# Altium project plp-cp_2a.PrjPcb
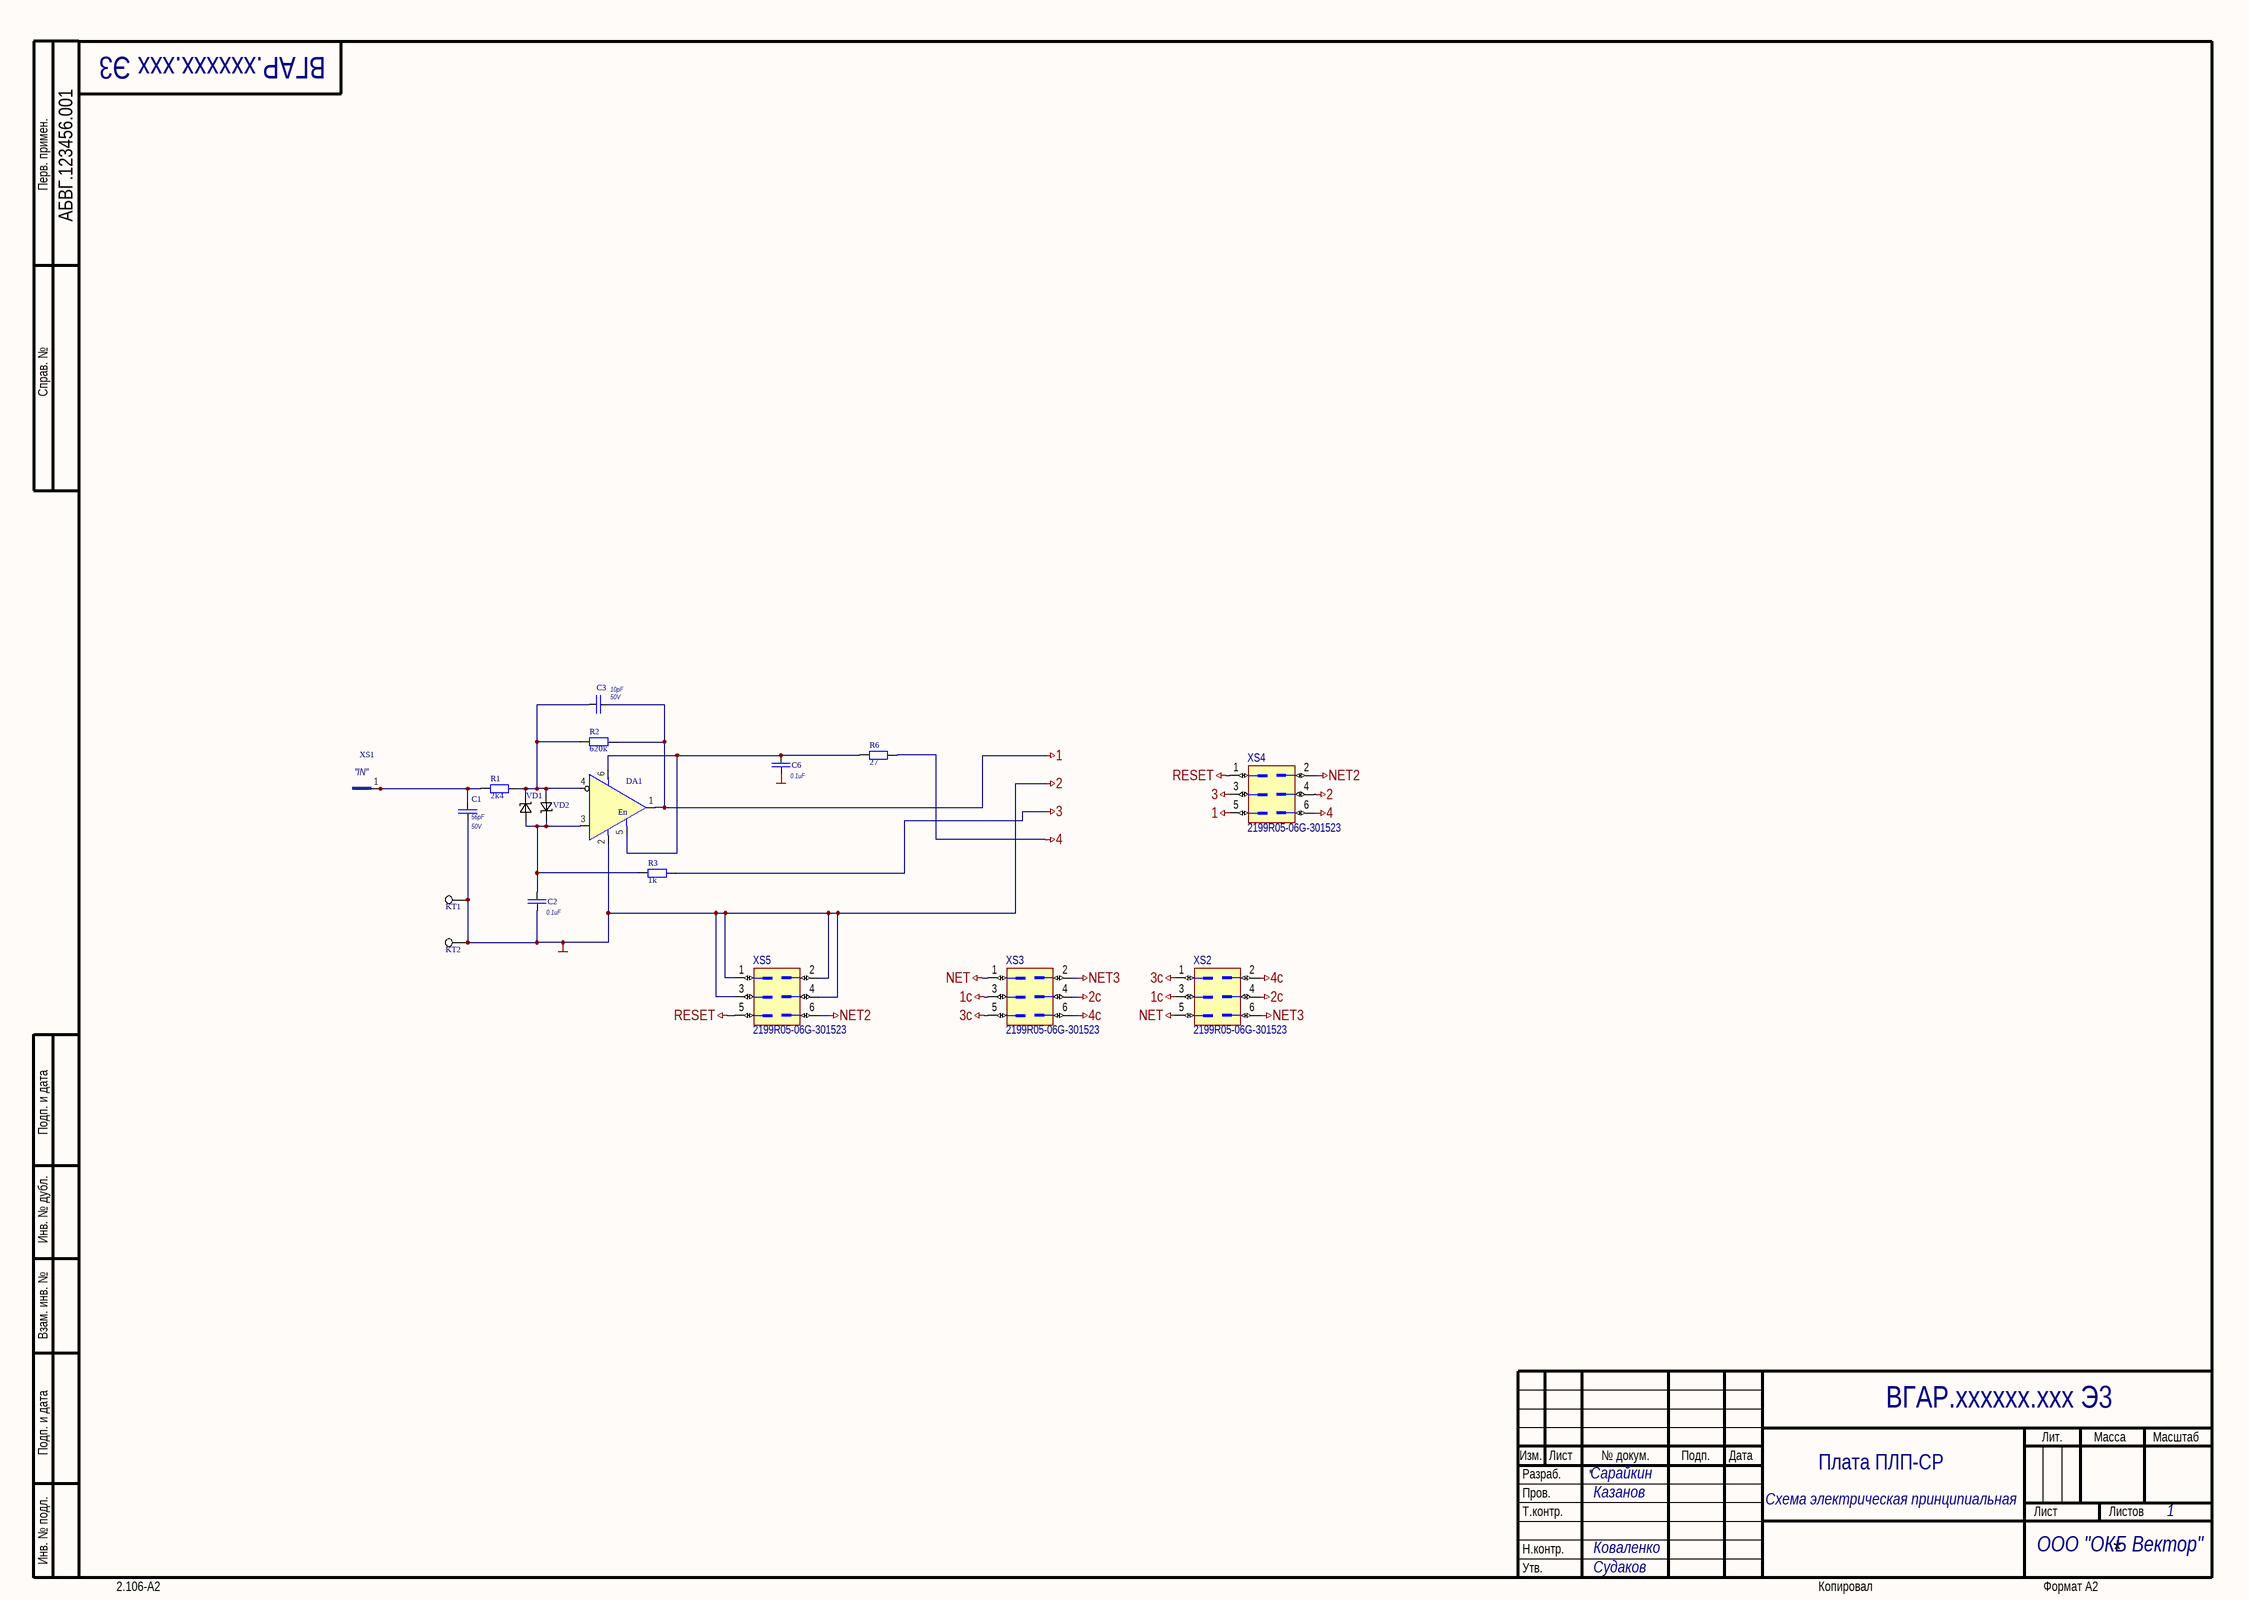
[diagram p0: plp-cp_2a.SchDoc]
1 sheet, 18 parts. Net scope: global (net labels, ports and power ports of the same name join across sheets).
Board file: plp-cp_2a.PcbDoc

## Sheet plp-cp_2a.SchDoc
size 594 x 420 mm; PageSetup: Record=PageOptions|CenterHorizontal=False|CenterVertical=False|PrintScale=0.68|XCorrection=0.00|YCorrection=0.00|PrintKind=2|BorderSize=5000000|LeftOffset=0|BottomOffset=0|Orientation=2|PaperLength=4200|PaperWidth=2970|Scale=100|PaperSource=7|PrintQuality=600|MediaType=1|DitherType=10|PaperKind=A3|PrintScaleMode=1; FirstReferrence: АБВГ.123456.001; Rule: PcbType=ProtelPcb; Rule: PcbType=ProtelPcb; Rule: PcbType=ProtelPcb; Rule: PcbType=ProtelPcb; Rule: PcbType=ProtelPcb; Rule: PcbType=ProtelPcb; Rule: PcbType=ProtelPcb; Rule: PcbType=ProtelPcb; Rule: PcbType=ProtelPcb; Rule: PcbType=ProtelPcb; Rule: PcbType=ProtelPcb; Rule: PcbType=ProtelPcb

### Parts
C1  value 56pF  Rated DC Voltage: 50V  [CAPC_0603(1608)X080L]  (hidden comment: Capacitor Ceramic)
C2  value 0.1uF  [CAPC_0603(1608)X080L]  (hidden comment: Capacitor Ceramic)
C3  value 10pF  Rated DC Voltage: 50V  [CAPC_0603(1608)X080L]  (hidden comment: Capacitor Ceramic)
C6  value 0.1uF  [CAPC_0603(1608)X080L]  (hidden comment: Capacitor Ceramic)
DA1  OPA363AIDBV  [SOT23-6]  (value not drawn)
KT1  Testpoint-TH-1mm  [1mm PAD]  (value not drawn)  (net tie, no BOM)
KT2  Testpoint-TH-1mm  [1mm PAD]  (value not drawn)  (net tie, no BOM)
R1  value 2k4  [RESC1608(0603)X04L]  (hidden comment: R0603L)
R2  value 620k  [RESC1608(0603)X04L]  (hidden comment: R0603L)
R3  value 1k  [RESC1608(0603)X04L]  (hidden comment: R0603L)
R6  value 27  [RESC1608(0603)X04L]  (hidden comment: R0603L)
VD1  BAT54XV2  [SOD523 - ONs]  (value not drawn)
VD2  BAT54XV2  [SOD523 - ONs]  (value not drawn)
XS1  smd_pin  [smd_pin]  (value not drawn)
XS2  2199R05-06G-301523  [CON: PLL-6(2x3R1.27male)]
XS3  2199R05-06G-301523  [CON: PLL-6(2x3R1.27male)]
XS4  2199R05-06G-301523  [CON: PLL-6(2x3R1.27male)]
XS5  2199R05-06G-301523  [CON: PLL-6(2x3R1.27male)]

### Nets
1: C3.2 DA1.1(Vout) R2.2 XS4.5
1c: XS2.3 XS3.3
2: C1.2 C2.2 C6.2 DA1.2(-V) KT1.0 KT2.0 XS4.4 XS5.1 XS5.2 XS5.3 XS5.4  [also labelled GND]
2c: XS2.4 XS3.4
3: R3.2 XS4.3
3c: XS2.1 XS3.5
4: R6.1 XS4.6
4c: XS2.2 XS3.6
NET: XS2.5 XS3.1
NET2: XS4.2 XS5.6
NET3: XS2.6 XS3.2
RESET: XS4.1 XS5.5
NetC1_1: C1.1 R1.2 XS1.1
NetC2_1: C2.1 DA1.3(+In) R3.1 VD1.1(anode) VD2.2(catode)
NetC3_1: C3.1 DA1.4(-In) R1.1 R2.1 VD1.2(catode) VD2.1(anode)
NetC6_1: C6.1 DA1.5(EN) DA1.6(+V) R6.2

### Notes on the sheet
- ВГАР.xxxxxx.xxx Э3
- (near XS1) "IN"
- Плата ПЛП-CP
- Сарайкин
- Казанов
- Схема электрическая принципиальная
- 1
- Коваленко
- ООО "ОКБ Вектор"
- Судаков
- Перв. примен.
- Справ. №
- Подп. и дата
- Инв. № дубл.
- Взам. инв. №
- Разраб.
- Изм.
- Лист
- № докум.
- Подп.
- Дата
- Лит.
- Масса
- Масштаб
- Пров.
- Т.контр.
- Листов
- Инв. № подл.
- Утв.
- Н.контр.
- 2.106-A2
- Копировал
- Формат А2
- (in symbol OPA363AIDBV) En

### Library data of the parts
C1 = Capacitor Ceramic: Конденсатор; Manufacturer: Murata; ReplacementPart1Manufacturer: TDK; ReplacementPart2Manufacturer: Taiyo Yuden; ESR: * mOhm; OrderCode: 0603 - 56пФ ±10% - 50В - NPO; TC Code: NPO; Tolerance: ±5%; Case: 0603; ComponentLink1Description: Global Data; ComponentLink1URL: http://www.murata.com/products/capacitor/tech_data/index.html; ComponentLink2Description: Part Data Sheet; ComponentLink2URL: *; ComponentLink3Description: Replacement Data Sheet; ComponentLink3URL: *; ComponentLink4Description: Replacement 2 Data Sheet; ComponentLink4URL: *; PartNumber: *; ReplacementPart1PartNumber: *; ReplacementPart2PartNumber: *; Ripple Current Rating: *; Temperature Range: -55 to +125°C
C2 C6 = Capacitor Ceramic: Конденсатор; Manufacturer: Murata; ReplacementPart1Manufacturer: TDK; ReplacementPart2Manufacturer: Taiyo Yuden; ESR: * mOhm; OrderCode: 0603 - 0,1мкФ ±10% - 50В - X7R; TC Code: X7R; Tolerance: ±10%; Rated DC Voltage: 50V; Case: 0603; ComponentLink1Description: Global Data; ComponentLink1URL: http://www.murata.com/products/capacitor/tech_data/index.html; ComponentLink2Description: Part Data Sheet; ComponentLink2URL: *; ComponentLink3Description: Replacement Data Sheet; ComponentLink3URL: *; ComponentLink4Description: Replacement 2 Data Sheet; ComponentLink4URL: *; PartNumber: *; ReplacementPart1PartNumber: *; ReplacementPart2PartNumber: *; Ripple Current Rating: *; Temperature Range: -55 to +125°C
C3 = Capacitor Ceramic: Конденсатор; Manufacturer: Murata; ReplacementPart1Manufacturer: TDK; ReplacementPart2Manufacturer: Taiyo Yuden; ESR: * mOhm; OrderCode: 0603 - 10 пФ ±5% 50 В- NPO; TC Code: NPO; Tolerance: ±5%; Case: 0603; ComponentLink1Description: Global Data; ComponentLink1URL: http://www.murata.com/products/capacitor/tech_data/index.html; ComponentLink2Description: Part Data Sheet; ComponentLink2URL: *; ComponentLink3Description: Replacement Data Sheet; ComponentLink3URL: *; ComponentLink4Description: Replacement 2 Data Sheet; ComponentLink4URL: *; PartNumber: *; ReplacementPart1PartNumber: *; ReplacementPart2PartNumber: *; Ripple Current Rating: *; Temperature Range: -55 to +125°C
DA1 = OPA363AIDBV: Микросхема; Manufacturer: Texas Instruments; ComponentLink1Description: Data Sheet; ComponentLink1URL: http://focus.ti.com/lit/ds/symlink/opa363.pdf; ComponentLink2Description: Replacement 1 Data Sheet; ComponentLink2URL: *; ComponentLink3Description: Replacement 2 Data Sheet; ComponentLink3URL: *; PartNumber: OPA363AIDBV; ReplacementPart1Manufacturer: *; ReplacementPart1PartNumber: *; ReplacementPart1TopMarking: *; ReplacementPart2Manufacturer: *; ReplacementPart2PartNumber: *; ReplacementPart2TopMarking: *; TopMarking: *
KT1 KT2 = Testpoint-TH-1mm: Dummy Pad
R1 R3 R6 = R0603L: Резистор; Manufacturer: Bourns; Max Rated DC Voltage: 100 В; Power: 1/10 Вт; Rated DC Voltage: 50 В; Rated T: -55 °C to +125 °C; Resistance Code: 0603 {Value} Ом ±1 %; TKR: ±100 ppm; Tolerance: ±1 %; ComponentLink1Description: Data Sheet; ComponentLink1URL: http://smd.ru/files/upload/1207/ru/chip-resis.pdf; Case: 0603; ComponentLink2Description: Specific Res Only; ComponentLink2URL: *; ComponentLink3Description: Replacement Data Sheet; ComponentLink3URL: *; ComponentLink4Description: Replacement 2 Data Sheet; ComponentLink4URL: *; OrderCode: *; PartNumber: *; ReplacementPart1Manufacturer: *; ReplacementPart1PartNumber: *; ReplacementPart2Manufacturer: *; ReplacementPart2PartNumber: *; Temperature Range: -55 to +125°C
R2 = R0603L: Резистор; Manufacturer: Bourns; Max Rated DC Voltage: 100 В; Power: 1/10 Вт; Rated DC Voltage: 50 В; Rated T: -55 °C to +125 °C; Resistance Code: 0603 240 kОм ±1 %; TKR: ±100 ppm; Tolerance: ±1 %; ComponentLink1Description: Data Sheet; ComponentLink1URL: http://smd.ru/files/upload/1207/ru/chip-resis.pdf; Case: 0603; ComponentLink2Description: Specific Res Only; ComponentLink2URL: *; ComponentLink3Description: Replacement Data Sheet; ComponentLink3URL: *; ComponentLink4Description: Replacement 2 Data Sheet; ComponentLink4URL: *; OrderCode: *; PartNumber: *; ReplacementPart1Manufacturer: *; ReplacementPart1PartNumber: *; ReplacementPart2Manufacturer: *; ReplacementPart2PartNumber: *; Temperature Range: -55 to +125°C
VD1 VD2 = BAT54XV2: shottky diode; Manufacturer: ON Semiconductor; ComponentLink1Description: Data Sheet; ComponentLink2Description: Replacement 1 Data Sheet; ComponentLink3Description: Replacement 2 Data Sheet
XS2-XS5 = 2199R05-06G-301523Out: Step 1.27 R